# Altium schematic sheet breakbeam-interface.SchDoc
size A4
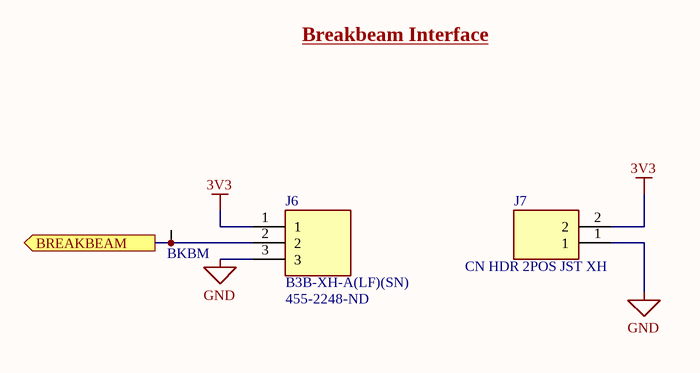
[diagram p0: breakbeam-interface.SchDoc]

## Parts
BKBM  Test Point (Via)  [TP]  (value not drawn)  (no BOM)
J6  B3B-XH-A(LF)(SN)  Supplier Part Number 1: 455-2248-ND  [JST_B3B-XH-A(LF)(SN)]
J7  CN HDR 2POS JST XH  [JST_B2B-XH-A(LF)(SN)]

## Ports
BREAKBEAM (out)

## Nets
3V3: J6.1 J7.2
GND: J6.3 J7.1
BREAKBEAM: BKBM.1 J6.2 ; port BREAKBEAM

## Notes on the sheet
- Breakbeam Interface

## Library data of the parts
J6 = CN HDR 3POS JST XH: Connector Header Through Hole 3 position 0.098 (2.50mm); MF: JST Sales; Check_prices: https://www.snapeda.com/parts/B3B-XH-A(LF)(SN)/JST%20Sales%20America%20Inc./view-part/231271/?ref=eda; Value: *; Package: None; Price: None; Availability: In Stock; MP: B3B-XH-A(LF)(SN); SnapEDA_Link: https://www.snapeda.com/parts/B3B-XH-A(LF)(SN)/JST%20Sales%20America%20Inc./view-part/231271/?ref=snap; Supplier 1: Digi-Key; Part Number: CN HDR 3POS JST XH; Manufacturer Part Number 1: B3B-XH-A(LF)(SN); Supplier URL 1: https://www.digikey.com/en/products/detail/jst-sales-america-inc/B3B-XH-A-LF-SN/1651046
J7 = CN HDR 2POS JST XH: Connector Header Through Hole 2 position 0.098 _2.50mm_ / JST XH; MP: B2B-XH-A_LF__SN_; MF: JST Sales; Price: None; Package: None; Value: *; SnapEDA_Link: https://www.snapeda.com/parts/B2B-XH-A%28LF%29%28SN%29/JST%20Sales%20America%20Inc./view-part/492310/?ref=snap; Part Number: CN HDR 2POS JST XH; Pin Count: 2
BKBM = Test Point (Via): Part Number: Test Point (Via)